# Altium project 应变片击打感应.PrjPcb
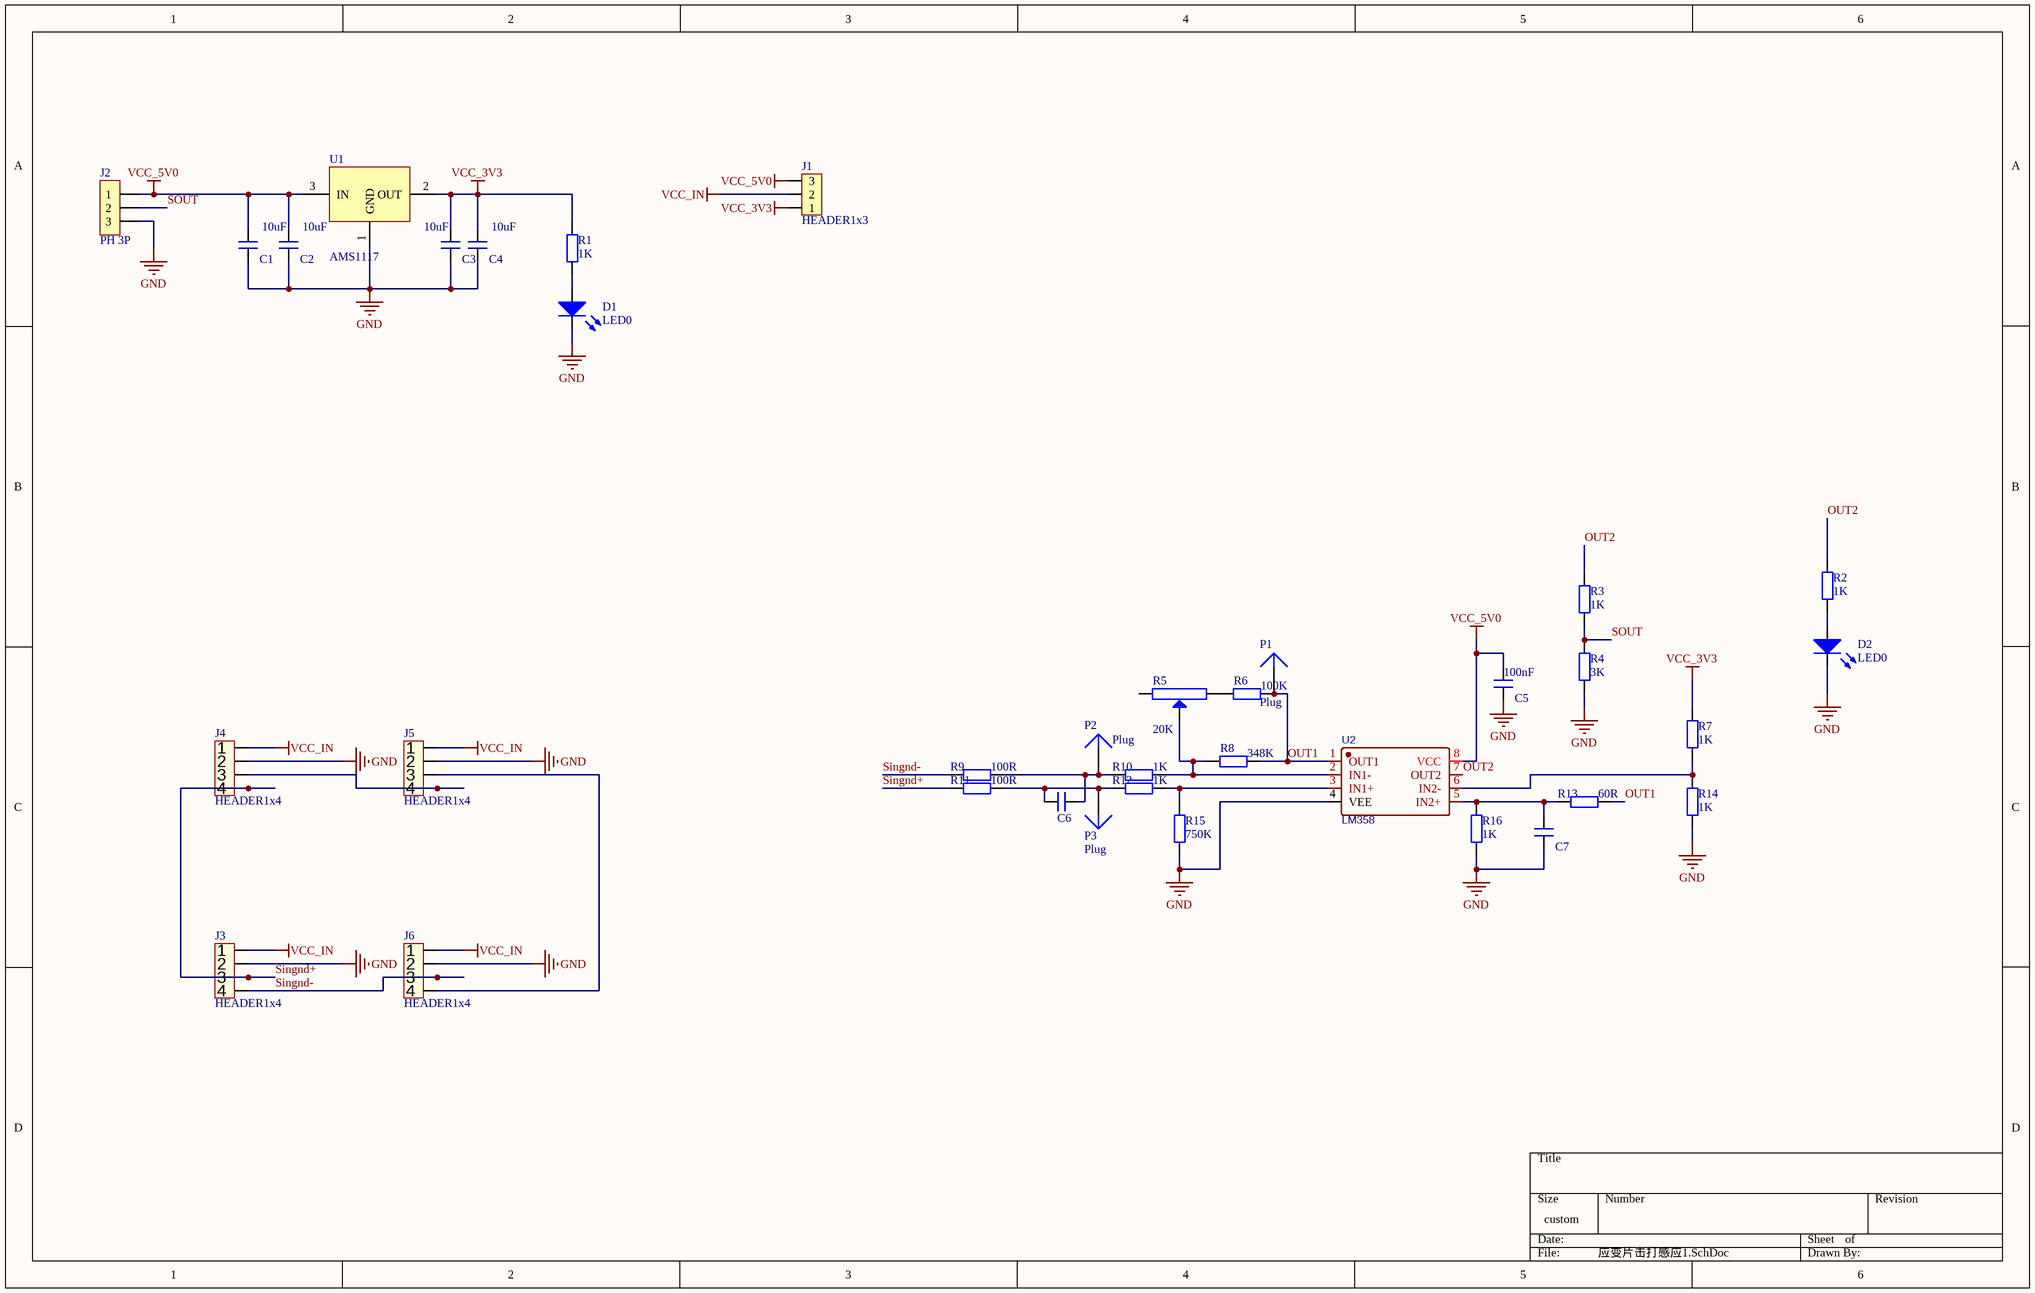
[diagram p0: 应变片击打感应1.SchDoc]
1 sheet, 36 parts. Net scope: global (net labels, ports and power ports of the same name join across sheets).
Board files: 应变片击打感应模块.PcbDoc, 应变片击打感应模块（串联版）.PcbDoc

## Sheet 应变片击打感应1.SchDoc
size 381 x 241 mm

### Parts
C1  10uF  [0603_C]
C2  10uF  [1210_C]
C3  10uF  [0603_C]
C4  10uF  [1210_C]
C5  100nF  [0603_C]
C6  ?uF  [0603_C]  (value not drawn)
C7  ?uF  [0603_C]  (value not drawn)
D1  LED0  [LED-0603]
D2  LED0  [LED-0603]
J1  HEADER1x3  [排针排母 3P 2.54mm]
J2  PH 3P  [XH 3P 2.54mm 立 贴]
J3  HEADER1x4  [PH 4P 2mm 卧 贴]
J4  HEADER1x4  [PH 4P 2mm 卧 贴]
J5  HEADER1x4  [PH 4P 2mm 卧 贴]
J6  HEADER1x4  [PH 4P 2mm 卧 贴]
P1  Plug  [PIN1]
P2  Plug  [PIN1]
P3  Plug  [PIN1]
R1  1K  [0603_R]
R2  1K  [0603_R]
R3  1K  [0603_R]
R4  3K  [0603_R]
R5  20K  [3296X]
R6  100K  [0603_R]
R7  1K  [0603_R]
R8  348K  [0603_R]
R9  100R  [0603_R]
R10  1K  [0603_R]
R11  100R  [0603_R]
R12  1K  [0603_R]
R13  60R  [0603_R]
R14  1K  [0603_R]
R15  750K  [0603_R]
R16  1K  [0603_R]
U1  AMS1117  [AMS1117]
U2  LM358  [SOP-8]

### Nets
GND: C1.1 C2.1 C3.1 C4.1 C5.2 C7.2 D1.2(K) D2.2(K) J2.3 J3.2 J4.2 J5.2 J6.2 R4.1 R14.1 R15.1 R16.1 U1.1(GND) U2.4(VEE)
VCC_3V3: C3.2 C4.2 J1.1 R1.2 R7.2 U1.2(OUT)
VCC_5V0: C1.2 C2.2 C5.1 J1.3 J2.1 U1.3(IN) U2.8(VCC)
VCC_IN: J1.2 J3.1 J4.1 J5.1 J6.1
OUT1: P1.1 R6.2 R8.2 R13.2 U2.1(OUT1)
OUT2: R2.2 R3.2 U2.7(OUT2)
Singnd+: J3.3 J4.4 R11.1
Singnd-: J3.4 J6.3 R9.1
SOUT: J2.2 R3.1 R4.2
NetC6_1: C6.1 P2.1 R9.2 R10.1
NetC6_2: C6.2 P3.1 R11.2 R12.1
NetC7_1: C7.1 R13.1 R16.2 U2.5(IN2+)
NetD1_1: D1.1(A) R1.1
NetD2_1: D2.1(A) R2.1
NetJ4_3: J4.3 J5.4
NetJ5_3: J5.3 J6.4
NetR5_2: R5.2 R8.1 R10.2 U2.2(IN1-)
NetR5_3: R5.3 R6.1
NetR7_1: R7.1 R14.2 U2.6(IN2-)
NetR12_2: R12.2 R15.2 U2.3(IN1+)

Not connected (* = marked no-connect by the designer): R5 1

### Library data of the parts
C1-C7 = Cap: Published: 8-Jun-2000; LatestRevisionDate: 17-Jul-2002; LatestRevisionNote: Re-released for DXP Platform.; PackageReference: RAD-0.3; Publisher: Altium Limited
R1-R4 R6-R16 = Res: Published: 8-Jun-2000; LatestRevisionDate: 17-Jul-2002; LatestRevisionNote: Re-released for DXP Platform.; PackageReference: AXIAL-0.4; Publisher: Altium Limited
R5 = 精密可调电阻20K
U1 = AMS1117: 线性稳压3.3V-5V 1A
U2 = LM358: BOM_Manufacturer: BLUE ROCKET; Contributor: LCSC; BOM_Supplier: LCSC; BOM_Supplier Part: C328566; BOM_Manufacturer Part: LM358; spicePre: U; spiceSymbolName: LM358
D1 D2 = LED0: Published: 8-Jun-2000; LatestRevisionDate: 08-Jul-2005; LatestRevisionNote: Mech Layer 1 removed.; PackageReference: LED-0; Publisher: Altium Limited
P1-P3 = Plug: LatestRevisionDate: 17-Jul-2002; LatestRevisionNote: Re-released for DXP Platform.; Publisher: Altium Limited